# EAGLE schematic irrigationControl (EAGLE 9.0.0)
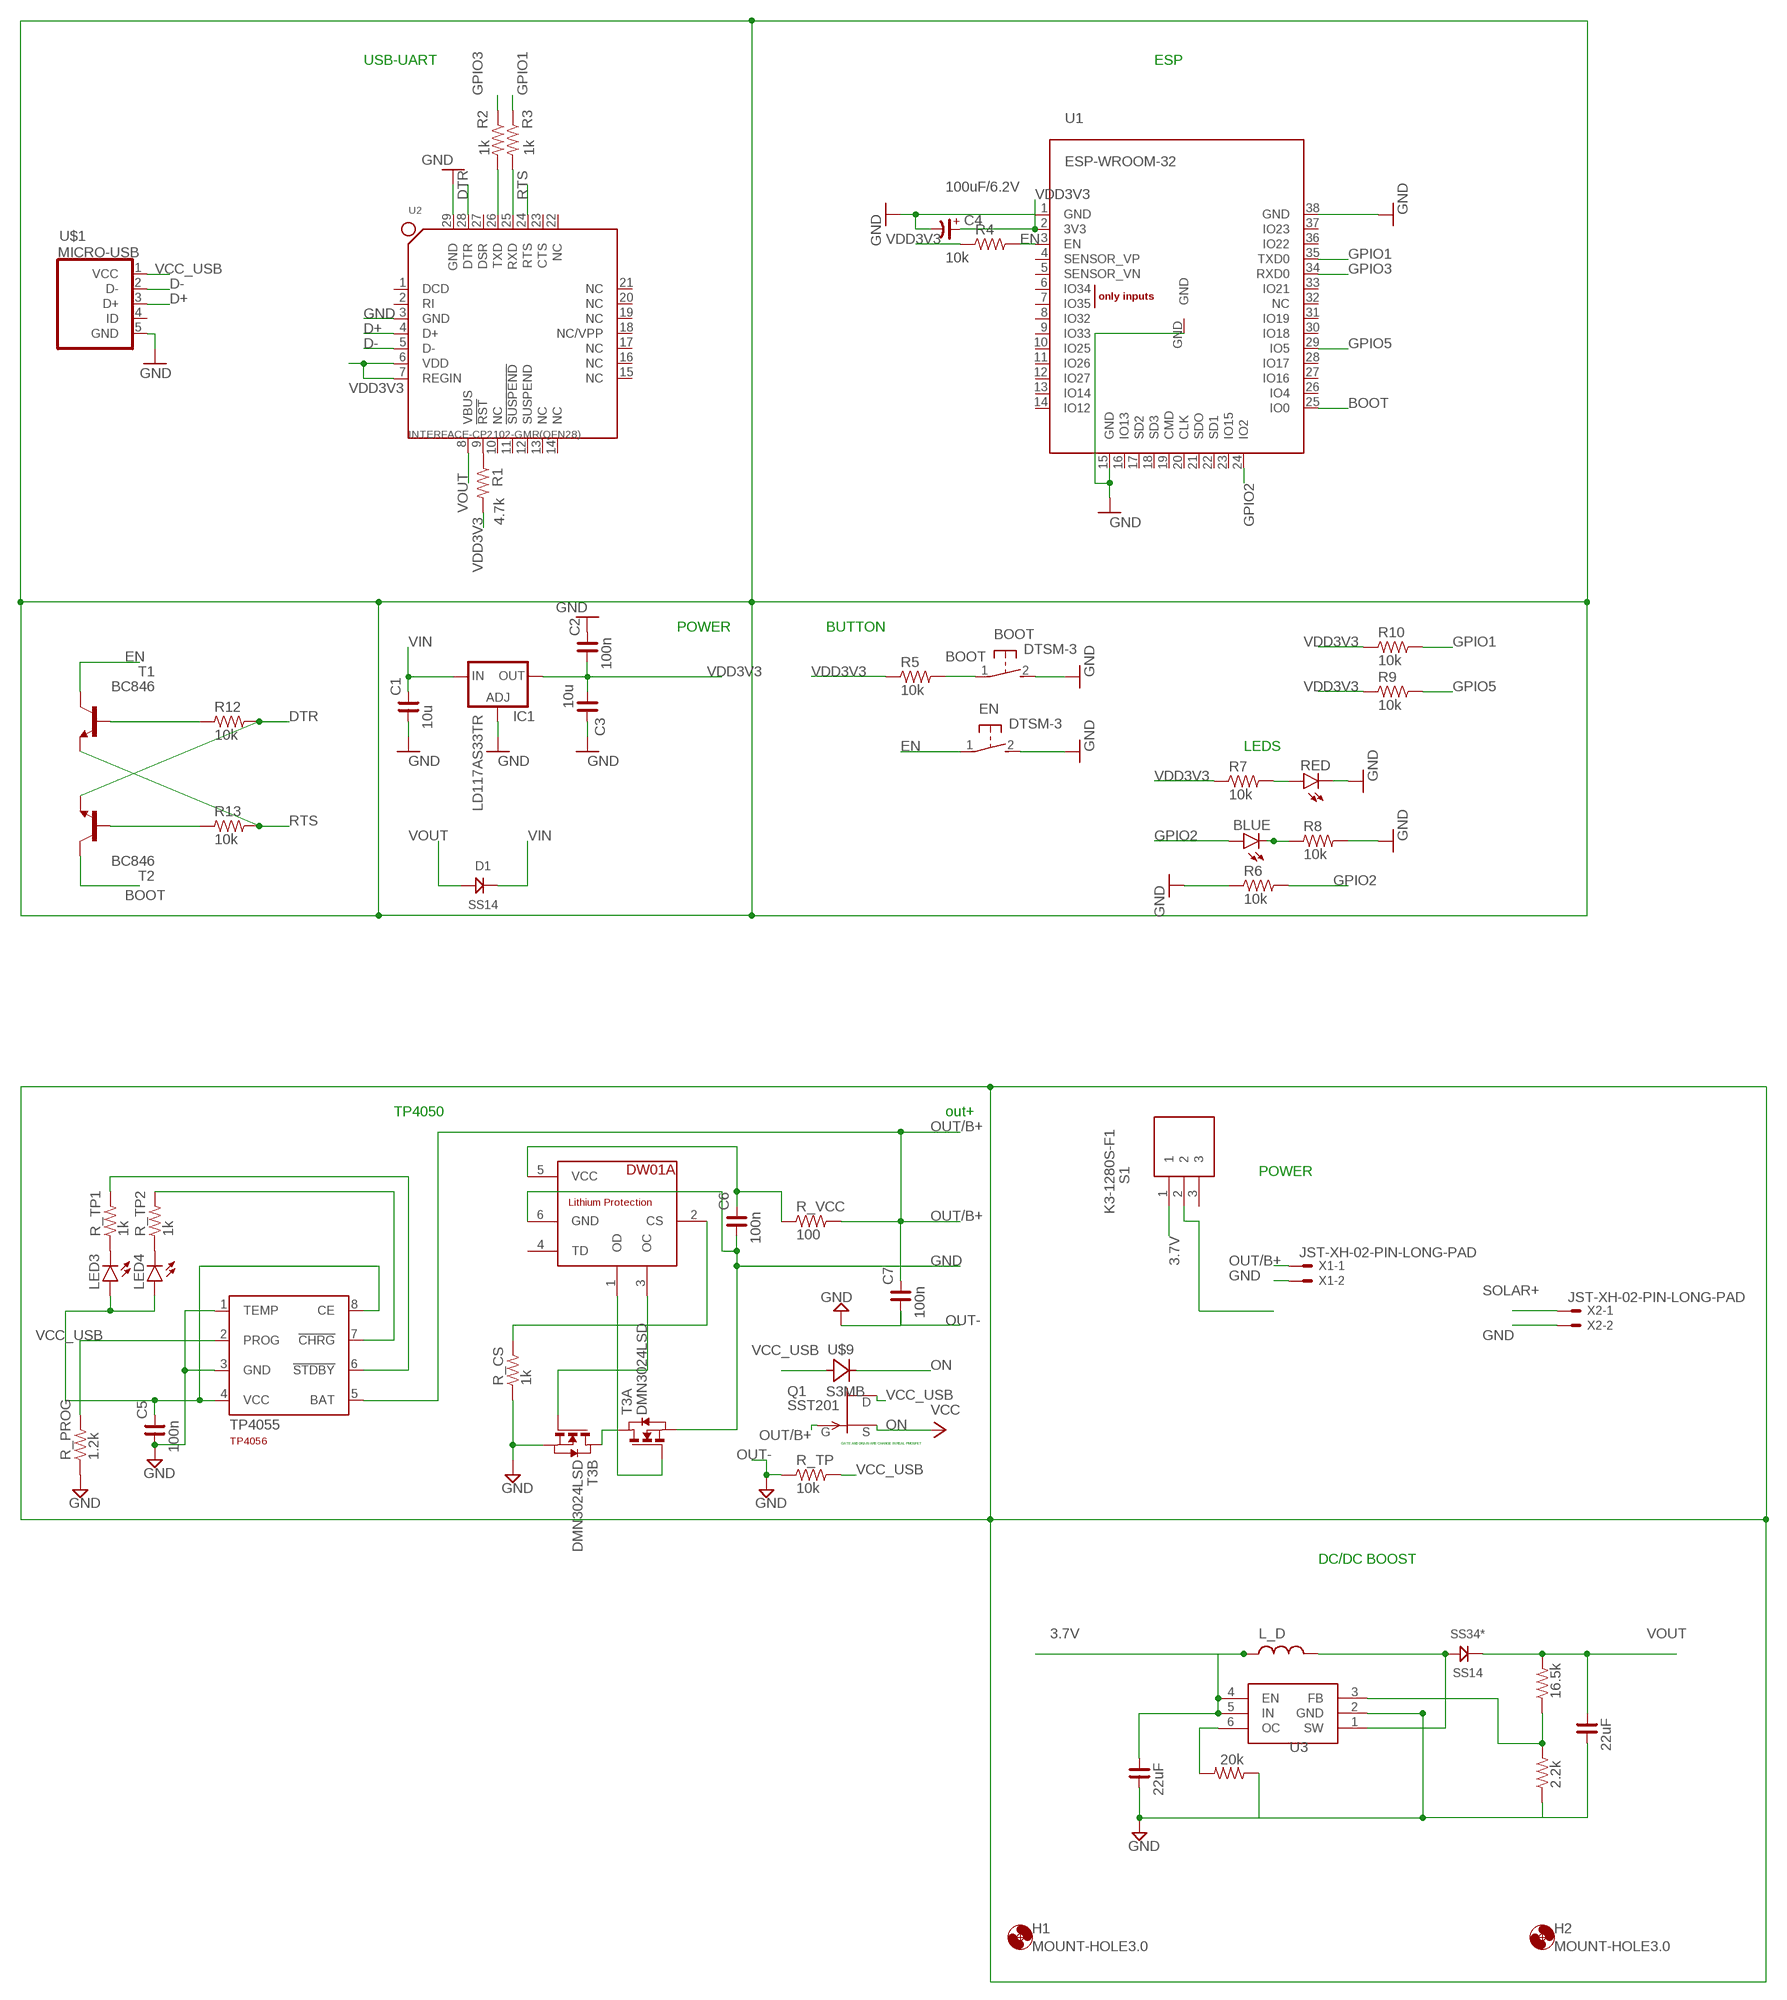
[diagram p0: schematic, sheet 1]

## Parts
BLUE  blue  LEDCHIPLED_0603  [CHIPLED_0603]
BOOT  DTSM-3  [DTSM-3]
C1  10u  C_0603  [C0603]
C1BOOST  22uF  C_1206  [C1206]
C2  100n  C_0603  [C0603]
C2BOOST  22uF  C_1206  [C1206]
C3  10u  C_0603  [C0603]
C4  100uF/6.2V  CP_3216-18  [C3216-18/T]
C5  100n  C_0603  [C0603]
C6  100n  C_0603  [C0603]
C7  100n  C_0603  [C0603]
D1  SS14  [DO214]
DW01A  DW01A  [SOT23-6]
EN  DTSM-3  [DTSM-3]
H1  MOUNT-HOLE3.0  [3,0]
H2  MOUNT-HOLE3.0  [3,0]
IC1  LD117AS33TR  [SOT223]
L_D  SLW6045S221MST  [SLW6045S221MST]
LED3  LED3MM  [LED3MM]
LED4  LED3MM  [LED3MM]
Q1  SST201  [SOT23]
R1  4.7k  R_0603  [R0603]
R2  1k  R_0603  [R0603]
R3  1k  R_0603  [R0603]
R4  10k  R_0603  [R0603]
R5  10k  R_0603  [R0603]
R6  10k  R_0603  [R0603]
R7  10k  R_0603  [R0603]
R8  10k  R_0603  [R0603]
R9  10k  R_0603  [R0603]
R10  10k  R_0603  [R0603]
R12  10k  R_0603  [R0603]
R13  10k  R_0603  [R0603]
R_CS  1k  R_0603  [R0603]
R_PROG  1.2k  R_0603  [R0603]
R_TP  10k  R_0603  [R0603]
R_TP1  1k  R_0603  [R0603]
R_TP2  1k  R_0603  [R0603]
R_VCC  100  R_0603  [R0603]
RED  red  LEDCHIPLED_0603  [CHIPLED_0603]
RESISTOR1BOOST  16.5k  R_0603  [R0603]
RESISTOR1BOOST2  2.2k  R_0603  [R0603]
RESISTOR1BOOST3  20k  R_0603  [R0603]
S1  K3-1280S-F1  [K31280SF1]
SS34*  SS14  [DO214]
T1  BC846  [SOT23]
T2  BC846  [SOT23]
T3  DMN3024LSD  [TSSOP-8]
TP4055  TP4056  [SOT23-8]
U1  ESP-WROOM-32  [ESP-WROOM-32]
U2  INTERFACE-CP2102-GMR(QFN28)  [QFN28G_0.5-5X5MM]
U3  MT3608  [SOT95P280X145-6N]
U$1  MICRO-USB  [MICRO-USB-2]
U$9  S3MB  [S3MB]
X1  JST-XH-02-PIN-LONG-PAD  [JST-XH-02-PACKAGE-LONG-PAD]
X2  JST-XH-02-PIN-LONG-PAD  [JST-XH-02-PACKAGE-LONG-PAD]

## Nets
3.7V: C1BOOST.2 L_D.1 S1.1 U3.4(EN) U3.5(IN)
BOOT: BOOT.1 R5.2 T2.3(C) U1.25(IO0)
D+: U2.4(D+) U$1.3(D+)
D-: U2.5(D-) U$1.2(D-)
DTR: R12.2 T2.2(E) U2.28(DTR)
EN: EN.1 R4.2 T1.3(C) U1.3(EN)
GND: BOOT.2 C1.1 C1BOOST.1 C2.2 C2BOOST.1 C3.2 C4.- C5.1 C6.1 DW01A.6(GND) EN.2 IC1.1(ADJ) R6.1 R8.2 R_CS.1 R_PROG.1 RED.C RESISTOR1BOOST2.1 RESISTOR1BOOST3.1 T3.2(A:S) T3.3(A:S) T3.6(B:S) T3.7(B:S) TP4055.1(TEMP) TP4055.3(GND) U1.1(GND) U1.15(GND) U1.38(GND) U1.GND U2.3(GND) U2.29(GND) U3.2(GND) U$1.5(GND) X1.2 X2.2
GPIO1: R3.1 R10.2 U1.35(TXD0)
GPIO2: BLUE.A R6.2 U1.24(IO2)
GPIO3: R2.1 U1.34(RXD0)
GPIO5: R9.2 U1.29(IO5)
N$1: R1.1 U2.9(!RST)
N$2: R2.2 U2.26(TXD)
N$3: R3.2 U2.25(RXD)
N$5: R12.1 T1.1(B)
N$6: R13.1 T2.1(B)
N$7: BLUE.C R8.1
N$10: L_D.2 SS34*.ANODE U3.1(SW)
N$11: RESISTOR1BOOST2.2 RESISTOR1BOOST.1 U3.3(FB)
N$14: RESISTOR1BOOST3.2 U3.6(OC)
N$15: LED3.K(C) R_TP1.1
N$16: LED4.K(C) R_TP2.1
N$23: R7.2 RED.A
N$29: R_TP2.2 TP4055.7(!CHRG)
N$30: R_TP1.2 TP4055.6(!STDBY)
N$31: R_PROG.2 TP4055.2(PROG)
N$32: T3.1(A:D) T3.8(B:D)
N$33: DW01A.3(OC) T3.5(B:G)
N$34: DW01A.2(CS) R_CS.2
N$35: DW01A.1(OD) T3.4(A:G)
N$36: C6.2 DW01A.5(VCC) R_VCC.1
ON: Q1.2(S) S1.2 U$9.- ; supply symbol labelled VCC
OUT-: C7.1 R_TP.1 ; supply symbol labelled GND
OUT/B+: C7.2 Q1.3(G) R_VCC.2 TP4055.5(BAT) X1.1
RTS: R13.2 T1.2(E) U2.24(RTS)
SOLAR+: X2.1
VCC_USB: C5.2 LED3.A LED4.A Q1.1(D) R_TP.2 TP4055.4(VCC) TP4055.8(CE) U$1.1(VCC) U$9.+
VDD3V3: C2.1 C3.1 C4.+ IC1.4(OUT) R1.2 R4.1 R5.1 R7.1 R9.1 R10.1 U1.2(3V3) U2.6(VDD) U2.7(REGIN)
VIN: C1.2 D1.CATHODE(KATHODE) IC1.3(IN)
VOUT: C2BOOST.2 D1.ANODE RESISTOR1BOOST.2 SS34*.CATHODE(KATHODE) U2.8(VBUS)
Unconnected: DW01A.4(TD) S1.3 U1.4(SENSOR_VP) U1.5(SENSOR_VN) U1.6(IO34) U1.7(IO35) U1.8(IO32) U1.9(IO33) U1.10(IO25) U1.11(IO26) U1.12(IO27) U1.13(IO14) U1.14(IO12) U1.16(IO13) U1.17(SD2) U1.18(SD3) U1.19(CMD) U1.20(CLK) U1.21(SDO) U1.22(SD1) U1.23(IO15) U1.26(IO4) U1.27(IO16) U1.28(IO17) U1.30(IO18) U1.31(IO19) U1.32(NC) U1.33(IO21) U1.36(IO22) U1.37(IO23) U2.1(DCD) U2.2(RI) U2.10(NC) U2.11(!SUSPEND) U2.12(SUSPEND) U2.13(NC) U2.14(NC) U2.15(NC) U2.16(NC) U2.17(NC) U2.18(NC/VPP) U2.19(NC) U2.20(NC) U2.21(NC) U2.22(NC) U2.23(CTS) U2.27(DSR) U$1.4(ID)

## Notes on the sheet
- USB-UART | ESP
- POWER | BUTTON
- LEDS
- TP4050 | out+
- POWER
- GATE AND DRAIN ARE CHANGE IN REAL PMOSFET
- DC/DC BOOST

## Library data of the parts
BLUE LED3 LED4 RED = led:LED: LED OSRAM: - CHIPLED LG R971, LG N971, LY N971, LG Q971, LY Q971, LO R971, LY R971 LH N974, LH R974 LS Q976, LO Q976, LY Q976 LO Q996 - Hyper CHIPLED LW Q18S LB Q993, LB Q99A, LB R99A - SideLED LS A670, LO A670, LY A670, LG A670, LP A670 LB A673, LV A673, LT A673, LW A673 LH A674 LY A675 LS A676, LA A676, LO A676, LY A676, LW A676 LS A679, LY A679, LG A679 - Hyper Micro SIDELED® LS Y876, LA Y876, LO Y876, LY Y876 LT Y87S - SmartLED LW L88C, LW L88S LB L89C, LB L89S, LG L890 LS L89K, LO L89K, LY L89K LS L896, LA L896, LO L896, LY L896 - TOPLED LS T670, LO T670, LY T670, LG T670, LP T670 LSG T670, LSP T670, LSY T670, LOP T670, LYG T670 LG T671, LOG T671, LSG T671 LB T673, LV T673, LT T673, LW T673 LH T674 LS T676, LA T676, LO T676, LY T676, LB T676, LH T676, LSB T676, LW T676 LB T67C, LV T67C, LT T67C, LS T67K, LO T67K, LY T67K, LW E67C LS E67B, LA E67B, LO E67B, LY E67B, LB E67C, LV E67C, LT E67C LW T67C LS T679, LY T679, LG T679 LS T770, LO T770, LY T770, LG T770, LP T770 LB T773, LV T773, LT T773, LW T773 LH T774 LS E675, LA E675, LY E675, LS T675 LS T776, LA T776, LO T776, LY T776, LB T776 LHGB T686 LT T68C, LB T68C - Hyper Mini TOPLED® LB M676 - Mini TOPLED Santana® LG M470 LS M47K, LO M47K, LY M47K Source: http://www.osram.convergy.de LUXEON: - LUMILED® LXK2-PW12-R00, LXK2-PW12-S00, LXK2-PW14-U00, LXK2-PW14-V00 LXK2-PM12-R00, LXK2-PM12-S00, LXK2-PM14-U00 LXK2-PE12-Q00, LXK2-PE12-R00, LXK2-PE12-S00, LXK2-PE14-T00, LXK2-PE14-U00 LXK2-PB12-K00, LXK2-PB12-L00, LXK2-PB12-M00, LXK2-PB14-N00, LXK2-PB14-P00, LXK2-PB14-Q00 LXK2-PR12-L00, LXK2-PR12-M00, LXK2-PR14-Q00, LXK2-PR14-R00 LXK2-PD12-Q00, LXK2-PD12-R00, LXK2-PD12-S00 LXK2-PH12-R00, LXK2-PH12-S00 LXK2-PL12-P00, LXK2-PL12-Q00, LXK2-PL12-R00 Source: www.luxeon.com KINGBRIGHT: KA-3528ASYC Source: www.kingbright.com
BOOT EN = switch-tact:DTSM-3
C1 C1BOOST C2 C2BOOST C3 C5-C7 = rc-master-smd:C_: NON-POLARIZED CAP
C4 = rc-master-smd:CP_: POLARIZED CAP
D1 SS34* = SS14:SS14: Check prices <https://pricing.snapeda.com/parts/SS14/ON%20Semiconductor/view-part?ref=eda>; AVAILABILITY: In Stock; DESCRIPTION: Diode Schottky 40V 1A Surface Mount DO-214AC (SMA); MF: ON Semiconductor; MP: SS14; PACKAGE: SMA-2 ON Semiconductor; PRICE: None; PURCHASE-URL: https://pricing.snapeda.com/search/part/SS14/?ref=eda
DW01A = DW01A:DW01A
H1 H2 = holes:MOUNT-HOLE: MOUNTING HOLE with drill center marker
IC1 = v-reg:LD117A?*: Low drop fixed and adjustable positive voltage regulators 1 A Source: http://www.st.com/stonline/products/literature/ds/7194/ld1117axx.pdf
L_D = SX1308:SLW6045S221MST
Q1 = transistor-fet:?20*: TEMIC / Siliconix N-Channel JFET Source: JFET-J201_Siliconix_data.pdf
R1-R10 R12 R13 R_CS R_PROG R_TP R_TP1 R_TP2 R_VCC RESISTOR1BOOST RESISTOR1BOOST2 RESISTOR1BOOST3 = rc-master-smd:R_: RESISTOR
S1 = K3-1280S-F1:K3-1280S-F1: Toggle Switches SMD RoHS Source: Datasheet <https://datasheet.lcsc.com/szlcsc/Korean-Hroparts-Elec-K3-1280S-F1_C92658.pdf>; DESCRIPTION: Toggle Switches SMD RoHS; HEIGHT: 3.7mm; MANUFACTURER_NAME: Korean Hroparts Elec; MANUFACTURER_PART_NUMBER: K3-1280S-F1
T1 T2 = transistor-neu-to92:BC846: NPN TRANSISTOR
T3 = FS8205A:DMN3024LSD: DUAL N-CHANNEL ENHANCEMENT MODE MOSFET data sheet <http://goo.gl/dRgboR> Dave.Calaway Eagle Library <https://goo.gl/Muy1Tr>
TP4055 = TP4056:TP4056: TP4056 Data sheet <http://goo.gl/J7k8TF> Dave.Calaway Eagle Library <https://goo.gl/Muy1Tr>
U1 = esp32:ESP-WROOM-32
U2 = CP2102-GMR_QFN28_:INTERFACE-CP2102-GMR(QFN28): 310070003 Check prices <https://pricing.snapeda.com/parts/CP2102-GMR/Silicon/view-part?ref=eda>; AVAILABILITY: In Stock; DESCRIPTION: USB Bridge, USB to UART USB 2.0 UART Interface 28-QFN (5x5); MF: Silicon; MP: CP2102-GMR; PACKAGE: VFQFN-28 Vishay Siliconix; PRICE: None; PURCHASE-URL: https://pricing.snapeda.com/search/part/CP2102-GMR/?ref=eda
U3 = MT3608:MT3608: High Efficiency 1.2MHz 2A Step Up Converter Source: Datasheet <https://www.olimex.com/Products/Breadboarding/BB-PWR-3608/resources/MT3608.pdf>; DESCRIPTION: High Efficiency 1.2MHz 2A Step Up Converter; HEIGHT: 1.45mm; MANUFACTURER_NAME: Aerosemi; MANUFACTURER_PART_NUMBER: MT3608
U$1 = SX1308:MICRO-USB
U$9 = SX1308:S3MB
X1 X2 = Rembrandt Electronics - JST XH Connectors v1-0:JST-XH-02-PIN: JST XH Connector 2 Pin Wire to board connector. Pitch: 2,54 mm, (0.100") Number of pins: 2 Created by Rembrandt Electronics www.rembrandtelectronics.com